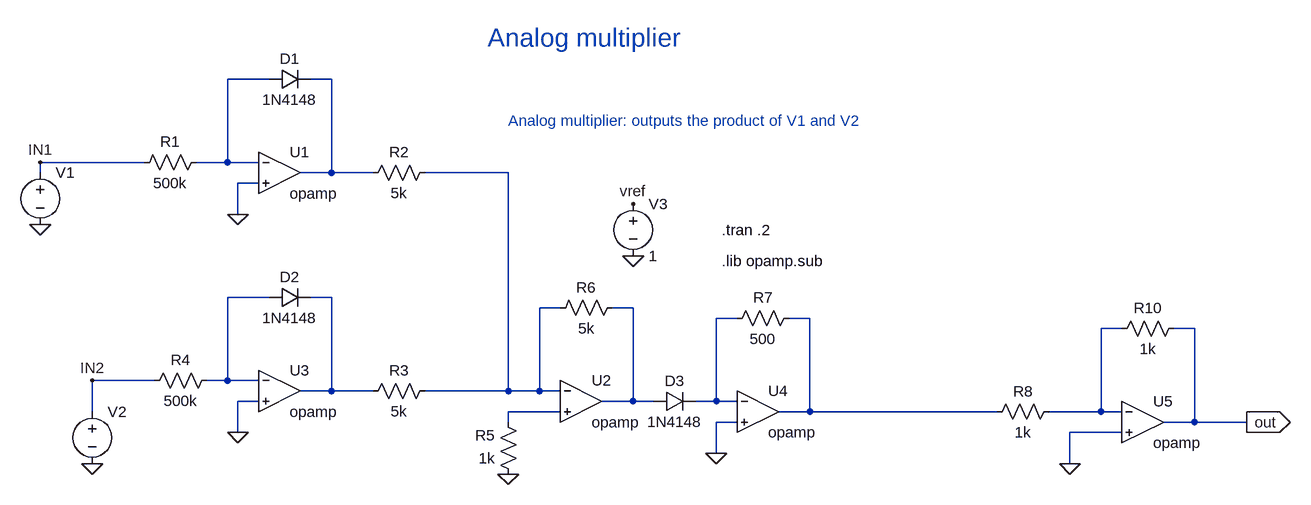
[diagram p0: schematic v1.0.asc]
v1.0.asc, the LTspice schematic file:
Version 4.1
SHEET 1 1792 952
WIRE 160 -16 96 -16
WIRE 256 -16 224 -16
WIRE -32 112 -192 112
WIRE 96 112 96 -16
WIRE 96 112 48 112
WIRE 144 112 96 112
WIRE -192 128 -192 112
WIRE 256 128 256 -16
WIRE 256 128 208 128
WIRE 320 128 256 128
WIRE 528 128 400 128
WIRE 144 144 112 144
WIRE 112 192 112 144
WIRE 160 320 96 320
WIRE 256 320 224 320
WIRE 608 336 576 336
WIRE 720 336 688 336
WIRE 880 352 848 352
WIRE 992 352 960 352
WIRE 1472 368 1440 368
WIRE 1584 368 1552 368
WIRE -16 448 -112 448
WIRE 96 448 96 320
WIRE 96 448 64 448
WIRE 144 448 96 448
WIRE 256 464 256 320
WIRE 256 464 208 464
WIRE 320 464 256 464
WIRE 528 464 528 128
WIRE 528 464 400 464
WIRE 576 464 576 336
WIRE 576 464 528 464
WIRE 608 464 576 464
WIRE 144 480 112 480
WIRE 720 480 720 336
WIRE 720 480 672 480
WIRE 752 480 720 480
WIRE 848 480 848 352
WIRE 848 480 816 480
WIRE 880 480 848 480
WIRE -112 496 -112 448
WIRE 608 496 528 496
WIRE 992 496 992 352
WIRE 992 496 944 496
WIRE 1280 496 992 496
WIRE 1440 496 1440 368
WIRE 1440 496 1360 496
WIRE 1472 496 1440 496
WIRE 528 512 528 496
WIRE 880 512 848 512
WIRE 1584 512 1584 368
WIRE 1584 512 1536 512
WIRE 1664 512 1584 512
WIRE 112 528 112 480
WIRE 1472 528 1392 528
WIRE 848 560 848 512
WIRE 1392 576 1392 528
FLAG -192 208 0
FLAG 112 192 0
FLAG 112 528 0
FLAG 528 592 0
FLAG 848 560 0
FLAG -192 112 IN1
FLAG -112 576 0
FLAG -112 448 IN2
FLAG 1392 576 0
FLAG 1664 512 out
IOPIN 1664 512 Out
FLAG 720 256 0
FLAG 720 176 vref
SYMBOL Opamps\\opamp 176 64 R0
SYMATTR InstName U1
SYMBOL voltage -192 112 R0
WINDOW 123 0 0 Left 2
WINDOW 39 0 0 Left 2
WINDOW 3 41 64 Invisible 2
SYMATTR InstName V1
SYMATTR Value SINE(0.2 0.2 20 0 0 0 10)
SYMBOL res 64 96 R90
WINDOW 0 0 56 VBottom 2
WINDOW 3 32 56 VTop 2
SYMATTR InstName R1
SYMATTR Value 500k
SYMBOL diode 160 0 R270
WINDOW 0 32 32 VTop 2
WINDOW 3 0 32 VBottom 2
SYMATTR InstName D1
SYMATTR Value 1N4148
SYMBOL Opamps\\opamp 176 400 R0
SYMATTR InstName U3
SYMBOL res 80 432 R90
WINDOW 0 0 56 VBottom 2
WINDOW 3 32 56 VTop 2
SYMATTR InstName R4
SYMATTR Value 500k
SYMBOL res 416 112 R90
WINDOW 0 0 56 VBottom 2
WINDOW 3 32 56 VTop 2
SYMATTR InstName R2
SYMATTR Value 5k
SYMBOL res 416 448 R90
WINDOW 0 0 56 VBottom 2
WINDOW 3 32 56 VTop 2
SYMATTR InstName R3
SYMATTR Value 5k
SYMBOL res 544 608 R180
WINDOW 0 36 76 Left 2
WINDOW 3 36 40 Left 2
SYMATTR InstName R5
SYMATTR Value 1k
SYMBOL Opamps\\opamp 640 416 R0
SYMATTR InstName U2
SYMBOL res 704 320 R90
WINDOW 0 0 56 VBottom 2
WINDOW 3 32 56 VTop 2
SYMATTR InstName R6
SYMATTR Value 5k
SYMBOL Opamps\\opamp 912 432 R0
SYMATTR InstName U4
SYMBOL res 976 336 R90
WINDOW 0 0 56 VBottom 2
WINDOW 3 32 56 VTop 2
SYMATTR InstName R7
SYMATTR Value 500
SYMBOL res 1376 480 R90
WINDOW 0 0 56 VBottom 2
WINDOW 3 32 56 VTop 2
SYMATTR InstName R8
SYMATTR Value 1k
SYMBOL Opamps\\opamp 1504 448 R0
SYMATTR InstName U5
SYMBOL res 1568 352 R90
WINDOW 0 0 56 VBottom 2
WINDOW 3 32 56 VTop 2
SYMATTR InstName R10
SYMATTR Value 1k
SYMBOL diode 160 336 R270
WINDOW 0 32 32 VTop 2
WINDOW 3 0 32 VBottom 2
SYMATTR InstName D2
SYMATTR Value 1N4148
SYMBOL diode 752 496 R270
WINDOW 0 32 32 VTop 2
WINDOW 3 0 32 VBottom 2
SYMATTR InstName D3
SYMATTR Value 1N4148
SYMBOL voltage -112 480 R0
WINDOW 123 0 0 Left 2
WINDOW 39 0 0 Left 2
WINDOW 3 41 64 Invisible 2
SYMATTR InstName V2
SYMATTR Value SINE(0.3 0.3 1k 0 0 0)
SYMBOL voltage 720 160 R0
WINDOW 123 0 0 Left 2
WINDOW 39 0 0 Left 2
SYMATTR InstName V3
SYMATTR Value 1
TEXT 856 264 Left 2 !.lib opamp.sub
TEXT 856 216 Left 2 !.tran .2
TEXT 528 48 Left 2 ;Analog multiplier: outputs the product of V1 and V2
TEXT 496 -80 Left 4 ;Analog multiplier

The netlist it stands for:
* v1.0.asc
X§U1 N001 0 N002 opamp Aol=100K GBW=10Meg  ; pins invin noninvin out
V1 IN1 0 SINE(0.2 0.2 20 0 0 0 10)
R1 N001 IN1 500k
D1 N001 N002 1N4148
X§U3 N004 0 N005 opamp Aol=100K GBW=10Meg  ; pins invin noninvin out
R4 N004 IN2 500k
R2 N003 N002 5k
R3 N003 N005 5k
R5 0 N010 1k
X§U2 N003 N010 N006 opamp Aol=100K GBW=10Meg  ; pins invin noninvin out
R6 N006 N003 5k
X§U4 N007 0 N008 opamp Aol=100K GBW=10Meg  ; pins invin noninvin out
R7 N008 N007 500
R8 N009 N008 1k
X§U5 N009 0 out opamp Aol=100K GBW=10Meg  ; pins invin noninvin out
R10 out N009 1k
D2 N004 N005 1N4148
D3 N006 N007 1N4148
V2 IN2 0 SINE(0.3 0.3 1k 0 0 0)
V3 vref 0 1
.model D D
.lib standard.dio
.lib opamp.sub
.tran .2
* Analog multiplier: outputs the product of V1 and V2
* Analog multiplier
.backanno
.end